# Altium schematic sheet CONN.SchDoc: Приемопередатчик  SDR200
size 420 x 297 mm; Author: В.Титов; DrawnBy: В.Титов; DocumentNumber: ХХХХ.468179.001 Э3; SheetNumber: 2; SheetTotal: 2; DocumentType: Схема электрическая принципиальная; Title2: Усилитель мощности; Scale: 1:1
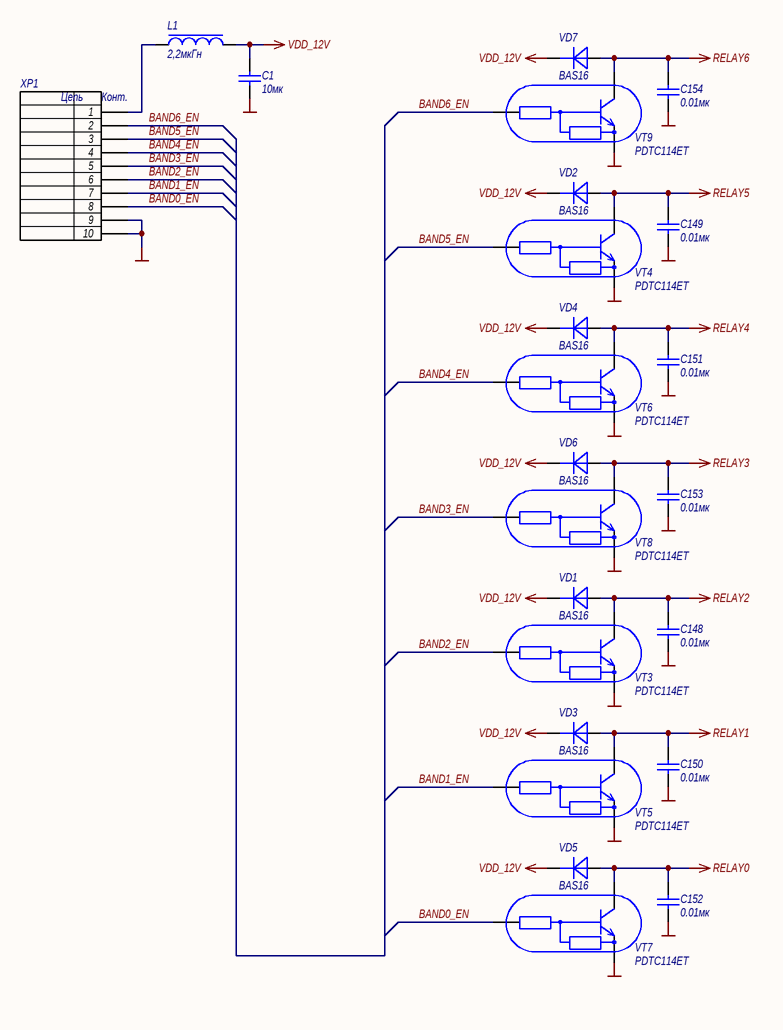
[diagram p0: CONN.SchDoc]

## Parts
C1  10мк  [CAPC3225X27L]
C148  0.01мк  [CAPC1005X06N]
C149  0.01мк  [CAPC1005X06N]
C150  0.01мк  [CAPC1005X06N]
C151  0.01мк  [CAPC1005X06N]
C152  0.01мк  [CAPC1005X06N]
C153  0.01мк  [CAPC1005X06N]
C154  0.01мк  [CAPC1005X06N]
L1  2,2мкГн  [CSAB0420]
VD1  BAS16  [SOT23_N]
VD2  BAS16  [SOT23_N]
VD3  BAS16  [SOT23_N]
VD4  BAS16  [SOT23_N]
VD5  BAS16  [SOT23_N]
VD6  BAS16  [SOT23_N]
VD7  BAS16  [SOT23_N]
VT3  PDTC114ET  [SOT23_N]
VT4  PDTC114ET  [SOT23_N]
VT5  PDTC114ET  [SOT23_N]
VT6  PDTC114ET  [SOT23_N]
VT7  PDTC114ET  [SOT23_N]
VT8  PDTC114ET  [SOT23_N]
VT9  PDTC114ET  [SOT23_N]
XP1  FH12-10S-0.5SVA  [FH12-10S-0.5SH]  (value not drawn)

## Nets
GND: C1.1 C148.1 C149.1 C150.1 C151.1 C152.1 C153.1 C154.1 VT3.2(E) VT4.2(E) VT5.2(E) VT6.2(E) VT7.2(E) VT8.2(E) VT9.2(E) XP1.9 XP1.10
RELAY0: C152.2 VD5.1(A) VT7.3(C)
RELAY1: C150.2 VD3.1(A) VT5.3(C)
RELAY2: C148.2 VD1.1(A) VT3.3(C)
RELAY3: C153.2 VD6.1(A) VT8.3(C)
RELAY4: C151.2 VD4.1(A) VT6.3(C)
RELAY5: C149.2 VD2.1(A) VT4.3(C)
RELAY6: C154.2 VD7.1(A) VT9.3(C)
VDD_12V: C1.2 L1.2 VD1.3(K) VD2.3(K) VD3.3(K) VD4.3(K) VD5.3(K) VD6.3(K) VD7.3(K)
BAND0_EN: VT7.1(B) XP1.8
BAND1_EN: VT5.1(B) XP1.7
BAND2_EN: VT3.1(B) XP1.6
BAND3_EN: VT8.1(B) XP1.5
BAND4_EN: VT6.1(B) XP1.4
BAND5_EN: VT4.1(B) XP1.3
BAND6_EN: VT9.1(B) XP1.2
NetL1_1: L1.1 XP1.1

## Notes on the sheet
- Перв. примен.
- Справ. №
- Подп. и дата
- Инв. № дубл.
- Взам. инв. №
- Изм
- Лист
- № докум
- Подп.
- Дата
- Лит.
- Масса
- Масштаб
- Т. контр.
- Разраб.
- Пров.
- Листов
- Н. контр.
- Инв. № подп.
- Утв.
- Копировал
- Формат А3
- (in symbol Соединитель FH12-10S-0.5SVA) Цепь; Конт.

## Library data of the parts
C1 = Кер.ЧИП конд. 1210 10мкФ X5R 20% 50В: Кер. ЧИП-конденсатор; Manufacturer: Murata; ManufacturerPartNumber: GRM32ER71H106; Power/Voltage: 50В; TKE: X5R; Tolerance: ±20%; Value: 10мк
C148-C154 = Кер.ЧИП конд. 0402 0.01мкФ X7R 10%, 50В: Кер. ЧИП-конденсатор; Power/Voltage: 50В; TKE: X7R; Tolerance: ±20%; Value: 0.01мк
L1 = ЧИП индуктивность CSAB0420-2R2M: Molding Power Choke; Manufacturer: Vishay; ManufacturerPartNumber: IHLP1616ABER1R0M11; Value: 2,2мкГн
VD1-VD7 = ЧИП диод BAS16: High-speed switching diodes; Manufacturer: Nexperia; Power/Voltage: 100В; ManufacturerPartNumber: BAS16; Value: BAS16; ComponentLink1Description: datasheet; ComponentLink1URL: https://assets.nexperia.com/documents/data-sheet/BAS16_SER.pdf
VT3-VT9 = ЧИП транзистор PDTC114ET: NPN resistor-equipped transistors;  R1 = 10 k, R2 = 10; ComponentLink1Description: datasheet; ComponentLink1URL: https://assets.nexperia.com/documents/data-sheet/PDTC114E_SER.pdf; Value: PDTC114ET
XP1 = Соединитель FH12-10S-0.5SVA: 0.5mm  Pitch FPC/FFC Connector FH12 Series; Manufacturer: Hirose; Value: FH12-10S-0.5SVA